# EAGLE board SNCHN_II-01 (EAGLE 5.11), part 1 of 3
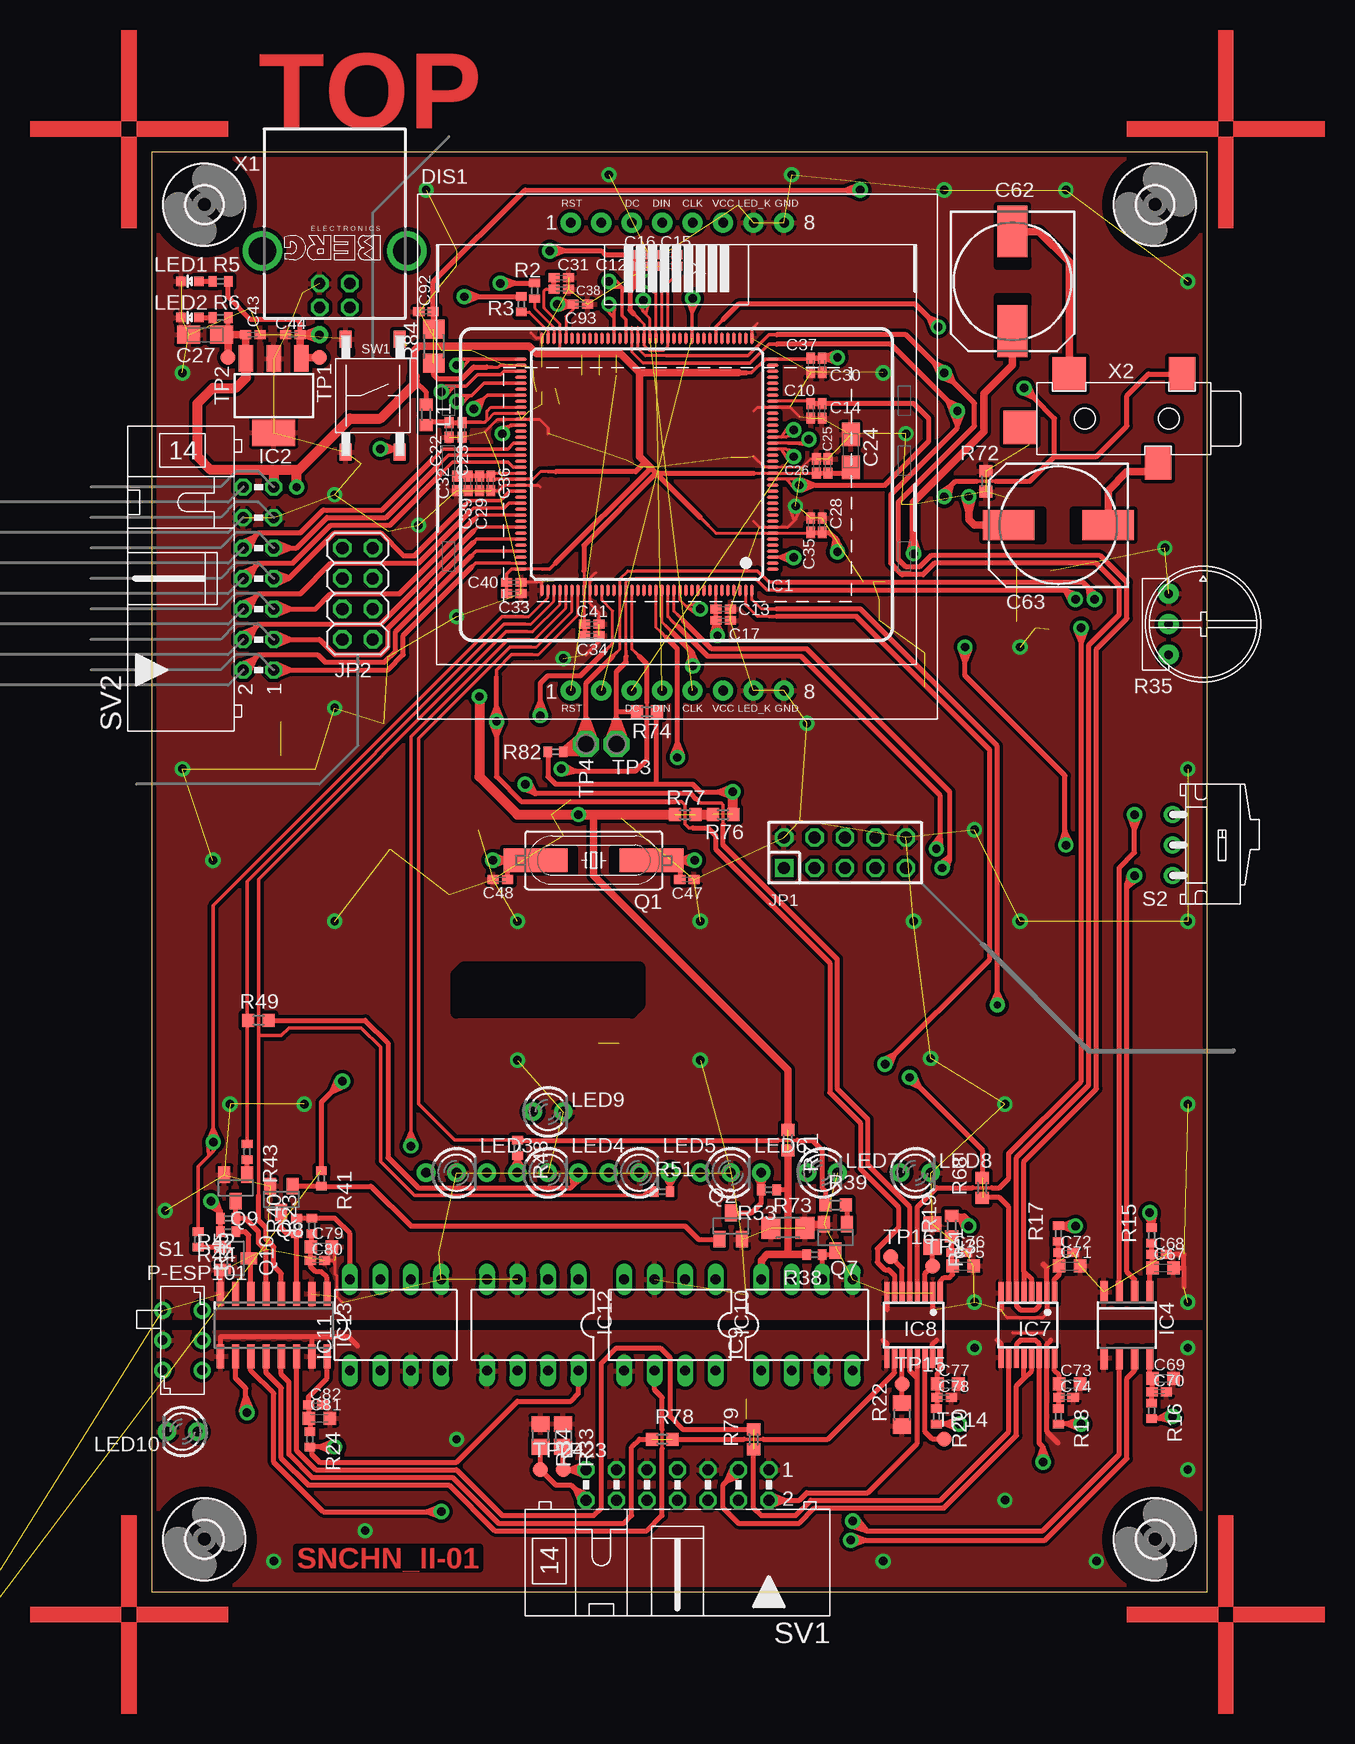
[diagram p3: board, top side]
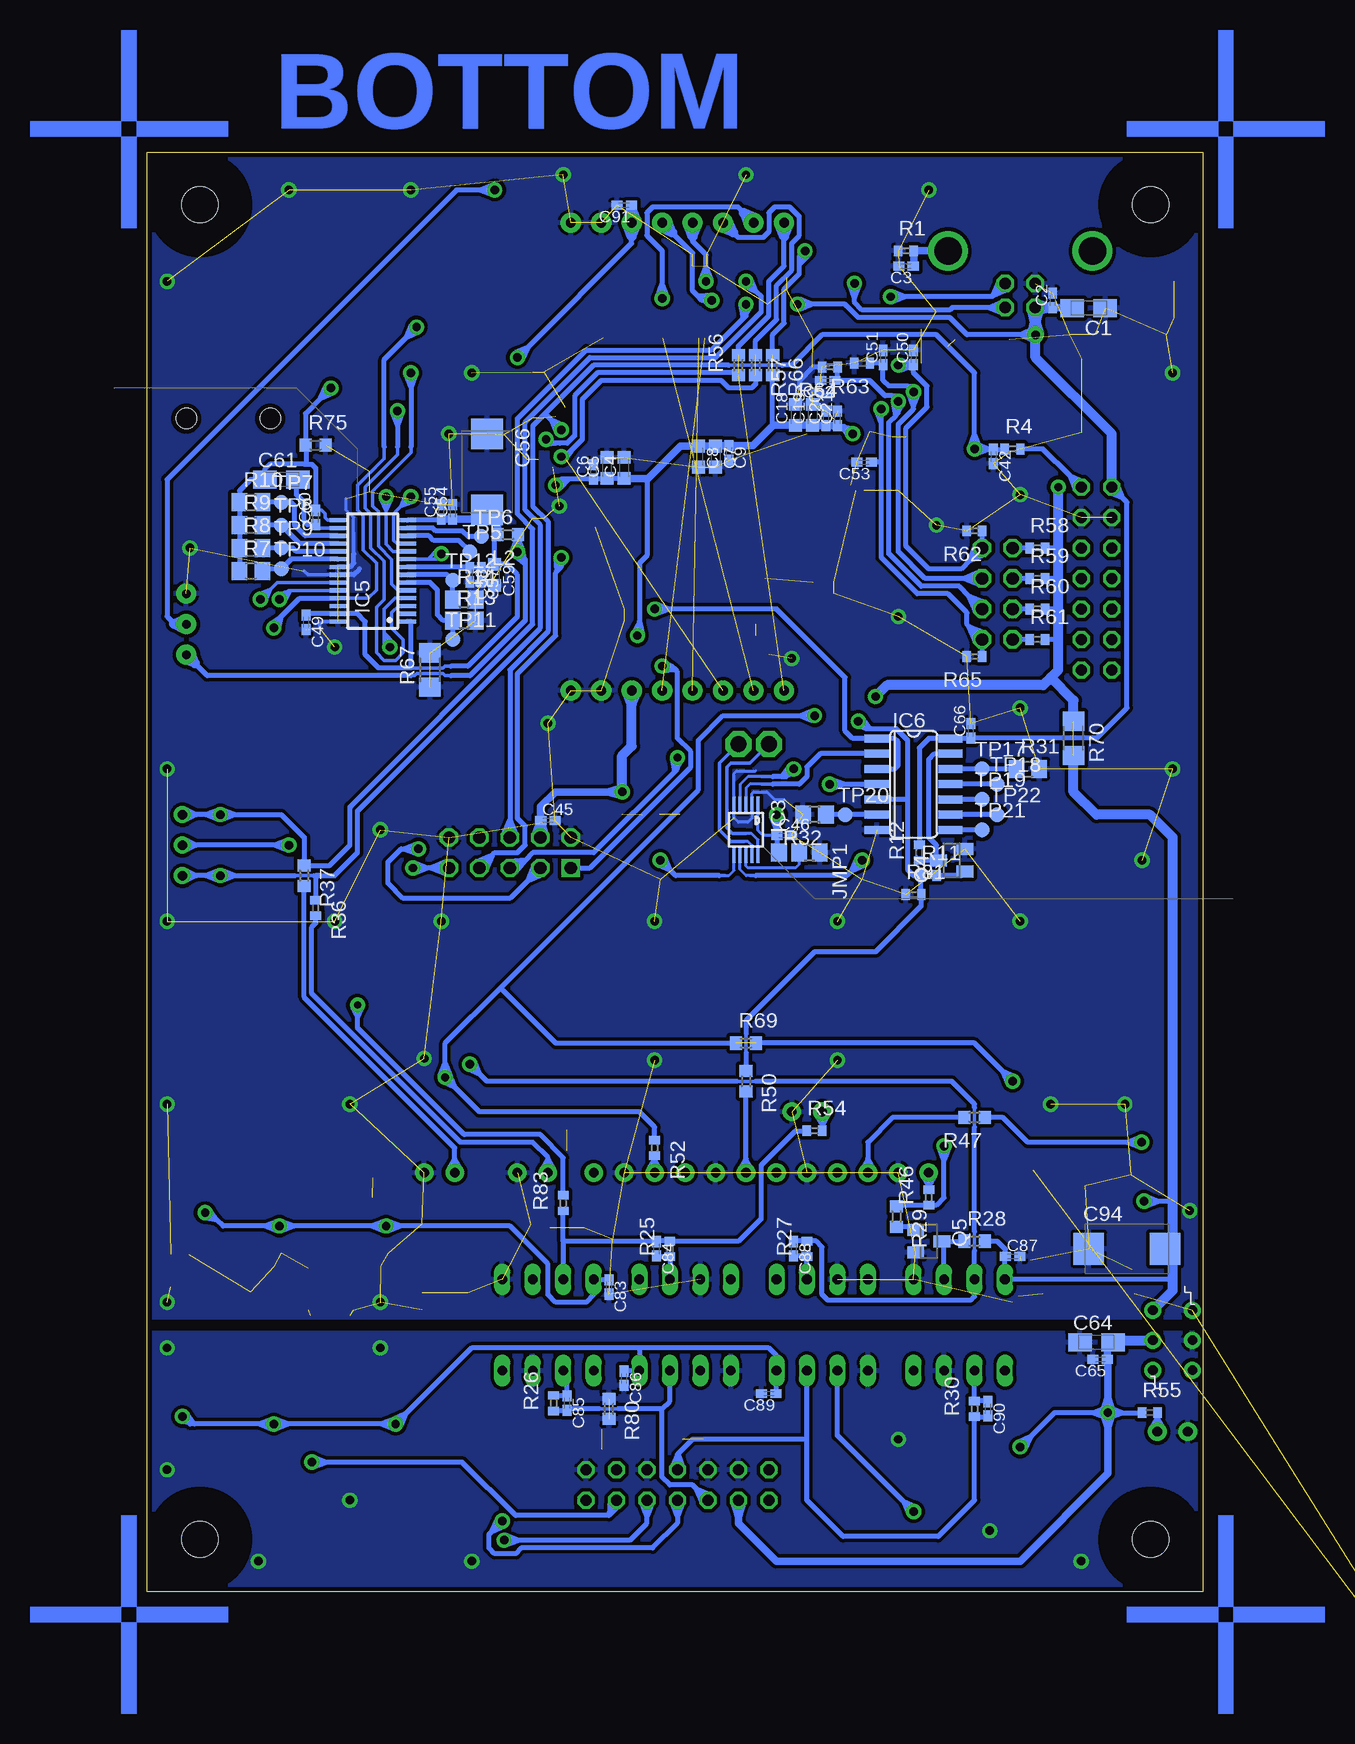
[diagram p4: board, bottom side, seen from below]

Size 88 x 120 mm. Coordinates in mm from the lower left corner, seen from the top.
Outline: 88,0 88,120 0,120 0,0 88,0
Copper layers (1*16): Top 0.035mm / dielectric 1.5mm / Bottom 0.035mm
Design rules "ALPS leptarna_clearance_0_2_mm_via_not_strict *": minimum track width 0.19mm, minimum drill 0.3mm, track to track 0.2mm, track to pad 0.2mm, pad to pad 0.2mm, via to via 0.2mm, smd to smd 0.2mm, copper to edge 0.4mm, drill to drill 0.5mm, minimum pad ring 10mil, minimum via ring 8mil, stop-mask expansion 3mil, vias tented up to drill 0mil, thermal gap 10mil
tRestrict: area 25.4,48.3 to 40.6,52.1; area 70.5,107.3 to 73,107.9; area 70.5,110.5 to 73,111.1; area 76.8,87.6 to 77.5,90.2; area 73.7,87.6 to 74.3,90.2; area 34.9,60 to 35.2,61.9; area 38.4,60 to 38.7,61.9; area 15.7,95.9 to 16.7,96.2; area 20.2,95.9 to 21.1,96.2; area 15.7,103.2 to 16.7,103.5; area 20.2,103.2 to 21.1,103.5

## Footprints (pad centres in the part's own frame; a part is rotated, then mirrored left to right if it is on the bottom)
A/3216-18R = smd 1.95 x 1.5: + 1.375,0; - -1.375,0
C0402K = smd 0.925 x 0.74: 1 -0.6,0; 2 0.6,0
C0603R = smd 1.05 x 1.08: 1 -0.875,0; 2 0.875,0
D/7343-31R = smd 2.55 x 2.7: + 3.175,0; - -3.175,0
140CLH-1010 = smd 4.3 x 2.5: + 4.15,0; - -4.15,0
LCD_NOKIA_5510_PLUS_EXT_BRD = drill 0.8 pad 1.676 round: 1 -8.89,19.5; 1@1 -8.89,-19.5; 2 -6.35,19.5; 2@1 -6.35,-19.5; 3 -3.81,19.5; 3@1 -3.81,-19.5; 4 -1.27,19.5; 4@1 -1.27,-19.5; 5 1.27,19.5; 5@1 1.27,-19.5; 6 3.81,19.5; 6@1 3.81,-19.5; 7 6.35,19.5; 7@1 6.35,-19.5; 8 8.89,19.5; 8@1 8.89,-19.5
LQFP144 = smd 0.25 x 1: 1 -8.75,-10.5; 2 -8.25,-10.5; 3 -7.75,-10.5; 4 -7.25,-10.5; 5 -6.75,-10.5; 6 -6.25,-10.5; 7 -5.75,-10.5; 8 -5.25,-10.5; 9 -4.75,-10.5; 10 -4.25,-10.5; 11 -3.75,-10.5; 12 -3.25,-10.5; 13 -2.75,-10.5; 14 -2.25,-10.5; 15 -1.75,-10.5; 16 -1.25,-10.5; 17 -0.75,-10.5; 18 -0.25,-10.5; 19 0.25,-10.5; 20 0.75,-10.5; 21 1.25,-10.5; 22 1.75,-10.5; 23 2.25,-10.5; 24 2.75,-10.5; 25 3.25,-10.5; 26 3.75,-10.5; 27 4.25,-10.5; 28 4.75,-10.5; 29 5.25,-10.5; 30 5.75,-10.5; 31 6.25,-10.5; 32 6.75,-10.5; 33 7.25,-10.5; 34 7.75,-10.5; 35 8.25,-10.5; 36 8.75,-10.5; 73 8.75,10.5; 74 8.25,10.5; 75 7.75,10.5; 76 7.25,10.5; 77 6.75,10.5; 78 6.25,10.5; 79 5.75,10.5; 80 5.25,10.5; 81 4.75,10.5; 82 4.25,10.5; 83 3.75,10.5; 84 3.25,10.5; 85 2.75,10.5; 86 2.25,10.5; 87 1.75,10.5; 88 1.25,10.5; 89 0.75,10.5; 90 0.25,10.5; 91 -0.25,10.5; 92 -0.75,10.5; 93 -1.25,10.5; 94 -1.75,10.5; 95 -2.25,10.5; 96 -2.75,10.5; 97 -3.25,10.5; 98 -3.75,10.5; 99 -4.25,10.5; 100 -4.75,10.5; 101 -5.25,10.5; 102 -5.75,10.5; 103 -6.25,10.5; 104 -6.75,10.5; 105 -7.25,10.5; 106 -7.75,10.5; 107 -8.25,10.5; 108 -8.75,10.5 | smd 1 x 0.25: 37 10.5,-8.75; 38 10.5,-8.25; 39 10.5,-7.75; 40 10.5,-7.25; 41 10.5,-6.75; 42 10.5,-6.25; 43 10.5,-5.75; 44 10.5,-5.25; 45 10.5,-4.75; 46 10.5,-4.25; 47 10.5,-3.75; 48 10.5,-3.25; 49 10.5,-2.75; 50 10.5,-2.25; 51 10.5,-1.75; 52 10.5,-1.25; 53 10.5,-0.75; 54 10.5,-0.25; 55 10.5,0.25; 56 10.5,0.75; 57 10.5,1.25; 58 10.5,1.75; 59 10.5,2.25; 60 10.5,2.75; 61 10.5,3.25; 62 10.5,3.75; 63 10.5,4.25; 64 10.5,4.75; 65 10.5,5.25; 66 10.5,5.75; 67 10.5,6.25; 68 10.5,6.75; 69 10.5,7.25; 70 10.5,7.75; 71 10.5,8.25; 72 10.5,8.75; 109 -10.5,8.75; 110 -10.5,8.25; 111 -10.5,7.75; 112 -10.5,7.25; 113 -10.5,6.75; 114 -10.5,6.25; 115 -10.5,5.75; 116 -10.5,5.25; 117 -10.5,4.75; 118 -10.5,4.25; 119 -10.5,3.75; 120 -10.5,3.25; 121 -10.5,2.75; 122 -10.5,2.25; 123 -10.5,1.75; 124 -10.5,1.25; 125 -10.5,0.75; 126 -10.5,0.25; 127 -10.5,-0.25; 128 -10.5,-0.75; 129 -10.5,-1.25; 130 -10.5,-1.75; 131 -10.5,-2.25; 132 -10.5,-2.75; 133 -10.5,-3.25; 134 -10.5,-3.75; 135 -10.5,-4.25; 136 -10.5,-4.75; 137 -10.5,-5.25; 138 -10.5,-5.75; 139 -10.5,-6.25; 140 -10.5,-6.75; 141 -10.5,-7.25; 142 -10.5,-7.75; 143 -10.5,-8.25; 144 -10.5,-8.75
SOT223(S) = smd 1.219 x 2.235: 1 -2.311,-3.099; 2 0,-3.099; 3 2.311,-3.099 | smd 3.6 x 2.2: 4 0,3.099
MSOP10 = smd 0.25 x 1.3: 1 -1,-2.113; 2 -0.5,-2.113; 3 0,-2.113; 4 0.5,-2.113; 5 1,-2.113; 6 1,2.113; 7 0.5,2.113; 8 0,2.113; 9 -0.5,2.113; 10 -1,2.113
SOIC8 = smd 0.6 x 1.9: 1 -1.905,-2.75; 2 -0.635,-2.75; 3 0.635,-2.75; 4 1.905,-2.75; 5 1.905,2.75; 6 0.635,2.75; 7 -0.635,2.75; 8 -1.905,2.75
TSSOP28 = smd 0.35 x 1.4: 1 -4.225,-2.9; 2 -3.575,-2.9; 3 -2.925,-2.9; 4 -2.275,-2.9; 5 -1.625,-2.9; 6 -0.975,-2.9; 7 -0.325,-2.9; 8 0.325,-2.9; 9 0.975,-2.9; 10 1.625,-2.9; 11 2.275,-2.9; 12 2.925,-2.9; 13 3.575,-2.9; 14 4.225,-2.9; 15 4.225,2.9; 16 3.575,2.9; 17 2.925,2.9; 18 2.275,2.9; 19 1.625,2.9; 20 0.975,2.9; 21 0.325,2.9; 22 -0.325,2.9; 23 -0.975,2.9; 24 -1.625,2.9; 25 -2.275,2.9; 26 -2.925,2.9; 27 -3.575,2.9; 28 -4.225,2.9
SO14 = smd 0.66 x 2.032: 1 -3.81,-3.073; 2 -2.54,-3.073; 3 -1.27,-3.073; 4 0,-3.073; 5 1.27,-3.073; 6 2.54,-3.073; 7 3.81,-3.073; 8 3.81,3.073; 9 2.54,3.073; 10 1.27,3.073; 11 0,3.073; 12 -1.27,3.073; 13 -2.54,3.073; 14 -3.81,3.073
QSOP16 = smd 0.45 x 1.8: 1 -2.223,-2.69; 2 -1.587,-2.69; 3 -0.953,-2.69; 4 -0.318,-2.69; 5 0.318,-2.69; 6 0.953,-2.69; 7 1.587,-2.69; 8 2.223,-2.69; 9 2.223,2.69; 10 1.587,2.69; 11 0.953,2.69; 12 0.318,2.69; 13 -0.318,2.69; 14 -0.953,2.69; 15 -1.587,2.69; 16 -2.223,2.69
DIL08 = drill 0.813 long: 1 -3.81,-3.81; 2 -1.27,-3.81; 3 1.27,-3.81; 4 3.81,-3.81; 5 3.81,3.81; 6 1.27,3.81; 7 -1.27,3.81; 8 -3.81,3.81
SOIC16N = smd 0.6 x 2: 1 -4.445,-2.6; 2 -3.175,-2.6; 3 -1.905,-2.6; 4 -0.635,-2.6; 5 0.635,-2.6; 6 1.905,-2.6; 7 3.175,-2.6; 8 4.445,-2.6; 9 4.445,2.6; 10 3.175,2.6; 11 1.905,2.6; 12 0.635,2.6; 13 -0.635,2.6; 14 -1.905,2.6; 15 -3.175,2.6; 16 -4.445,2.6
A0R-JMP = smd 1.5 x 1.3: 1 0,1.7; 2 0,0; 3 0,-1.7
AVR-JTAG-10 = drill 1.016 square: 1 -5.08,-1.27 | drill 1.016 octagon: 2 -5.08,1.27; 3 -2.54,-1.27; 4 -2.54,1.27; 5 0,-1.27; 6 0,1.27; 7 2.54,-1.27; 8 2.54,1.27; 9 5.08,-1.27; 10 5.08,1.27
2X04 = drill 1.016 octagon: 1 -3.81,-1.27; 2 -3.81,1.27; 3 -1.27,-1.27; 4 -1.27,1.27; 5 1.27,-1.27; 6 1.27,1.27; 7 3.81,-1.27; 8 3.81,1.27
L0603 = smd 1 x 1.1: 1 -0.85,0; 2 0.85,0
LED-0603 = smd 0.8 x 0.8: A 0,-0.75; C 0,0.75
DUOLED-C-3MM = drill 0.8 pad 1.55 round: AR 2.54,0; AX -2.54,0; C 0,0
LED3MM = drill 0.8 pad 1.55 round: A -1.27,0; K 1.27,0
HC49UP = smd 5.334 x 1.93: 1 -4.826,0; 2 4.826,0
SOT23 = smd 1 x 1.4: 1 -0.95,-1.1; 2 0.95,-1.1; 3 0,1.1
R0402 = smd 0.7 x 0.9: 1 -0.65,0; 2 0.65,0
R0805 = smd 1.3 x 1.5: 1 -0.95,0; 2 0.95,0
R0603 = smd 1 x 1.1: 1 -0.85,0; 2 0.85,0
TRIM_3352T = drill 0.7 pad 1.676 round: 1 -2.54,2.21; 2 0,2.21; 3 2.54,2.21
R1206 = smd 1.6 x 1.803: 1 -1.422,0; 2 1.422,0
JS202011AQN = drill 0.8 pad 1.422 round: 1 -2.5,1.65; 2 0,1.65; 3 2.5,1.65; 4 -2.5,-1.65; 5 0,-1.65; 6 2.5,-1.65
P-ESP201X = drill 0.8 pad 1.422 round: O -2.54,-3.175; P 0,-3.175; S 2.54,-3.175
ML14L = drill 0.914 octagon: 1 -7.62,-1.27; 2 -7.62,1.27; 3 -5.08,-1.27; 4 -5.08,1.27; 5 -2.54,-1.27; 6 -2.54,1.27; 7 0,-1.27; 8 0,1.27; 9 2.54,-1.27; 10 2.54,1.27; 11 5.08,-1.27; 12 5.08,1.27; 13 7.62,-1.27; 14 7.62,1.27
B1720/SMD = smd 1.4 x 1: P$1 4.7,-2.25; P$2 -4.7,-2.25; P$3 4.7,2.25; P$4 -4.7,2.25
B1,27 = smd 1.27 x 1.27: PP 0,0
P1-13 = drill 1.321 pad 2.159 octagon: 1 0,0
3,0 = hole 3: 0,0
PN61729-S = drill 0.95 octagon: 1 1.25,4.71; 2 -1.25,4.71; 3 -1.25,2.71; 4 1.25,2.71 | drill 2.3 pad 2.9 round: S1 -6.02,0; S2 6.02,0
STEREO_JACK_3.5MM_SMD_SJ-352X-SMT = smd 2.8 x 2.2: P$1 -3.7,-2.4; P$3 3.7,-4.4 | smd 2.8 x 2.8: P$2 -3.7,-11.8; P$10 0.75,-15.9 | hole 1.7: 0,-3.5; 0,-10.5

## Placement (x,y rotation side)
C1  4.7uF  [A/3216-18R]  9.53,107 180 bottom
C2  100n  [C0402K]  12.54,107.63 90 bottom
C3  10n  [C0402K]  24.77,110.49 180 bottom
C4  1uF  [C0603R]  48.26,93.66 90 bottom
C5  1uF  [C0603R]  49.69,93.66 90 bottom
C6  470p  [C0402K]  50.8,93.34 90 bottom
C7  1uF  [C0603R]  40.64,94.61 270 bottom
C8  1uF  [C0603R]  42.07,94.61 270 bottom
C9  100n  [C0402K]  39.53,94.93 270 bottom
C10  2.7n  [C0402K]  54.93,98.42 270 top
C11  2.7n  [C0402K]  43.18,110.49 180 top
C12  2.7n  [C0402K]  40.8,110.49 0 top
C13  2.7n  [C0402K]  47.62,81.92 0 top
C14  33n  [C0402K]  55.88,98.42 270 top
C15  33n  [C0402K]  43.18,111.44 180 top
C16  33n  [C0402K]  40.8,111.44 0 top
C17  33n  [C0402K]  47.62,80.96 0 top
C18  1uF  [C0603R]  33.97,98.11 90 bottom
C19  1uF  [C0603R]  32.54,98.11 90 bottom
C20  33n  [C0402K]  31.43,97.79 90 bottom
C21  2.7n  [C0402K]  30.48,97.79 90 bottom
C22  100n  [C0402K]  24.77,96.84 270 top
C23  33n  [C0402K]  25.88,96.84 270 top
C24  4.7uF  [A/3216-18R]  58.26,95.09 270 top
C25  100n  [C0402K]  56.36,93.82 90 top
C26  33n  [C0402K]  55.4,93.82 90 top
C27  4.7uF  [A/3216-18R]  4.45,104.78 0 top
C28  100n  [C0402K]  55.88,88.9 90 top
C29  100n  [C0402K]  27.3,92.39 270 top
C30  100n  [C0402K]  55.88,102.23 270 top
C31  100n  [C0402K]  34.13,109.54 0 top
C32  100n  [C0402K]  25.4,92.39 270 top
C33  100n  [C0402K]  30.16,83.19 0 top
C34  100n  [C0402K]  36.67,79.69 0 top
C35  33n  [C0402K]  54.93,88.9 90 top
C36  33n  [C0402K]  28.26,92.39 270 top
C37  33n  [C0402K]  54.93,102.23 270 top
C38  33n  [C0402K]  34.13,108.58 0 top
C39  33n  [C0402K]  26.35,92.39 270 top
C40  33n  [C0402K]  30.16,84.14 0 top
C41  33n  [C0402K]  36.67,80.64 0 top
C42  100n  [C0402K]  17.46,94.61 270 bottom
C43  100n  [C0402K]  8.41,104.78 0 top
C44  100n  [C0402K]  11.75,104.78 180 top
C45  100n  [C0402K]  54.61,64.29 0 bottom
C46  100n  [C0402K]  34.92,63.02 0 bottom
C47  18pF  [C0402K]  44.61,59.37 0 top
C48  18pF  [C0402K]  29.05,59.37 180 top
C49  100n  [C0402K]  74.77,80.8 270 bottom
C50  100n  [C0402K]  24.13,102.87 90 bottom
C51  100n  [C0402K]  26.67,102.87 90 bottom
C52  100n  [C0402K]  31.27,100.97 180 bottom
C53  100n  [C0402K]  28.26,94.14 180 bottom
C54  100n  [C0402K]  62.55,90.01 90 bottom
C55  100n  [C0402K]  63.5,90.01 90 bottom
C56  100uF  [D/7343-31R]  59.69,93.34 270 bottom
C57  100n  [C0402K]  60.17,84.77 270 bottom
C58  100n  [C0402K]  61.12,84.77 270 bottom
C59  1uF  [C0603R]  59.05,84.77 270 bottom
C60  100n  [C0402K]  73.98,89.53 90 bottom
C61  4.7uF/16V  [A/3216-18R]  76.83,92.71 0 bottom
C62  220uF/16V  [140CLH-1010]  71.75,109.22 270 top
C63  220uF/16V  [140CLH-1010]  75.56,88.9 180 top
C64  4.7uF  [A/3216-18R]  8.89,20.8 0 bottom
C65  100n  [C0402K]  8.57,19.37 180 bottom
C66  100n  [C0402K]  19.37,71.75 90 bottom
C67  1uF  [C0603R]  84.3,26.99 0 top
C68  100n  [C0402K]  83.98,28.1 0 top
C69  1uF  [C0603R]  84.3,17.78 0 top
C70  100n  [C0402K]  83.98,16.67 0 top
C71  1uF  [C0603R]  76.52,27.15 0 top
C72  100n  [C0402K]  76.2,28.26 0 top
C73  1uF  [C0603R]  76.52,17.3 0 top
C74  100n  [C0402K]  76.2,16.19 0 top
C75  1uF  [C0603R]  67.63,27.15 0 top
C76  100n  [C0402K]  67.31,28.26 0 top
C77  1uF  [C0603R]  66.36,17.3 0 top
C78  100n  [C0402K]  66.04,16.19 0 top
C79  1uF  [C0603R]  14.13,28.73 0 top
C80  100n  [C0402K]  13.81,27.62 0 top
C81  1uF  [C0603R]  13.97,14.45 0 top
C82  100n  [C0402K]  13.65,15.56 0 top
C83  100n  [C0402K]  49.53,25.4 270 bottom
C84  //33pF  [C0402K]  45.56,28.57 270 bottom
C85  33pF  [C0402K]  53.02,15.72 270 bottom
C86  100n  [C0402K]  48.26,17.78 270 bottom
C87  100n  [C0402K]  15.88,27.94 0 bottom
C88  //33pF  [C0402K]  34.13,28.57 270 bottom
C89  100n  [C0402K]  36.2,16.51 180 bottom
C90  33pF  [C0402K]  17.94,15.24 270 bottom
C91  100n  [C0402K]  48.26,115.57 180 bottom
C92  100n  [C0402K]  22.86,106.68 0 top
C93  100n  [C0402K]  35.72,107.31 180 top
C94  100uF  [D/7343-31R]  6.35,28.57 0 bottom
DIS1  LCD_NOKIA_5510  [LCD_NOKIA_5510_PLUS_EXT_BRD]  43.81,94.61 0 top
IC1  32UC3A0512  [LQFP144]  41.27,93.98 90 top
IC2  MIC39100  [SOT223(S)]  10.16,99.69 180 top
IC3  CS2200  [MSOP10]  38.1,63.5 180 bottom
IC4  SI8421  [SOIC8]  81.28,22.23 180 top
IC5  TLV320AIC23B  [TSSOP28]  69.22,85.09 90 bottom
IC6  4066D  [SO14]  24.13,67.31 270 bottom
IC7  SI8642  [QSOP16]  73.03,22.23 180 top
IC8  SI8642  [QSOP16]  63.5,22.23 180 top
IC9  TLP22OO  [DIL08]  54.61,22.23 0 top
IC10  TLP22OO  [DIL08]  43.18,22.23 180 top
IC11  TLP22OO  [DIL08]  20.32,22.23 0 top
IC12  TLP22OO  [DIL08]  31.75,22.23 180 top
IC13  SI8640  [SOIC16N]  10.16,22.23 180 top
JMP1  0R-JUMPA  [A0R-JMP]  33.66,61.59 270 bottom
JP1  AVR-JTAG-10  [AVR-JTAG-10]  57.78,61.59 0 top
JP2  GPBTN[3:0]  [2X04]  17.14,83.19 270 top
L1  1.5 kOhm@100MHz  [L0603]  22.86,98.11 270 top
L2  1.5 kOhm@100MHz  [L0603]  57.94,88.11 180 bottom
LED1  Green@3mA  [LED-0603]  3.17,109.22 90 top
LED2  //Green@3mA  [LED-0603]  3.18,106.2 90 top
LED3  Red/Green@3mA  [DUOLED-C-3MM]  25.4,34.92 0 top
LED4  Red/Green@3mA  [DUOLED-C-3MM]  33.02,34.92 0 top
LED5  Red/Green@3mA  [DUOLED-C-3MM]  40.64,34.92 0 top
LED6  Red/Green@3mA  [DUOLED-C-3MM]  48.26,34.92 0 top
LED7  Green@3mA  [LED3MM]  55.88,34.92 0 top
LED8  Green@3mA  [LED3MM]  63.66,34.92 0 top
LED9  Red@3mA  [LED3MM]  33.02,40.01 0 top
LED10  Green@3mA  [LED3MM]  2.54,13.34 180 top
Q1  12 MHz  [HC49UP]  36.83,60.96 180 top
Q2  BSS138  [SOT23]  48.26,30.48 0 top
Q4  BSS138  [SOT23]  20.95,60.96 90 bottom
Q5  BSS138  [SOT23]  22.86,29.21 270 bottom
Q7  BSS138  [SOT23]  56.99,29.53 180 top
Q8  BSS138  [SOT23]  10.79,32.7 180 top
Q9  BSS138  [SOT23]  6.99,33.66 180 top
Q10  BSS138  [SOT23]  6.99,27.78 270 top
R1  1M0  [R0402]  24.77,111.76 0 bottom
R2  39R  [R0402]  31.91,108.43 270 top
R3  39R  [R0402]  30.8,107.31 270 top
R4  10k  [R0402]  15.88,95.25 0 bottom
R5  470R  [R0402]  5.71,109.22 0 top
R6  //470R  [R0402]  5.71,106.2 0 top
R7  0R  [R0805]  79.38,85.09 0 bottom
R8  0R  [R0805]  79.38,87 0 bottom
R9  0R  [R0805]  79.38,88.9 0 bottom
R10  100k  [R0805]  79.38,90.81 0 bottom
R11  10k  [R0402]  22.86,59.69 0 bottom
R12  47k  [R0402]  23.65,61.6 90 bottom
R13  100k  [R0805]  61.59,80.96 0 bottom
R14  100k  [R0805]  61.59,82.71 0 bottom
R15  20R  [R0402]  83.34,29.69 90 top
R16  20R  [R0402]  83.34,15.08 270 top
R17  20R  [R0402]  75.56,29.84 90 top
R18  20R  [R0402]  75.56,14.61 270 top
R19  20R  [R0603]  66.67,30.48 90 top
R20  20R  [R0402]  65.41,14.61 270 top
R21  0R  [R0805]  65.09,29.69 270 top
R22  0R  [R0805]  62.55,14.76 90 top
R23  20R  [R0402]  13.34,30.48 90 top
R24  20R  [R0402]  13.18,12.7 270 top
R25  270R  [R0402]  44.45,28.57 90 bottom
R26  1k1  [R0402]  54.13,15.72 90 bottom
R27  1k1  [R0402]  33.02,28.57 90 bottom
R28  47k  [R0603]  19.05,29.21 0 bottom
R29  10k  [R0603]  25.56,31.27 270 bottom
R30  1k1  [R0402]  19.05,15.24 90 bottom
R31  0R  [R0805]  14.61,68.58 0 bottom
R32  0R  [R0805]  32.38,64.77 180 bottom
R33  0R  [R0805]  34.29,13.02 270 top
R34  0R  [R0805]  32.38,13.02 270 top
R35  Volume  [TRIM_3352T]  82.55,80.64 270 top
R36  510R  [R0402]  73.98,56.99 270 bottom
R37  510R  [R0603]  74.93,59.69 270 bottom
R38  47k  [R0402]  55.24,28.1 180 top
R39  10k  [R0603]  56.99,32.23 0 top
R40  47k  [R0402]  12.06,30.48 90 top
R41  10k  [R0402]  14.13,34.45 270 top
R42  47k  [R0402]  6.35,31.11 180 top
R43  10k  [R0402]  7.94,36.67 270 top
R44  47k  [R0402]  6.35,30 180 top
R45  10k  [R0402]  3.85,29.36 270 top
R46  510R  [R0402]  22.86,32.86 90 bottom
R47  510R  [R0603]  19.05,39.53 180 bottom
R48  510R  [R0402]  30.48,36.99 270 top
R49  510R  [R0603]  8.89,47.62 0 top
R50  510R  [R0603]  38.1,42.55 270 bottom
R51  510R  [R0402]  42.55,33.34 0 top
R52  510R  [R0402]  45.72,36.99 270 bottom
R53  510R  [R0402]  51.44,33.5 180 top
R54  30R  [R0402]  32.38,38.42 0 bottom
R55  510R  [R0402]  4.45,14.92 0 bottom
R56  0R  [R0603]  38.73,102.23 90 bottom
R57  0R  [R0603]  37.31,102.23 270 bottom
R58  1k  [R0402]  13.81,87 0 bottom
R59  1k  [R0402]  13.81,84.45 0 bottom
R60  1k  [R0402]  13.81,81.92 0 bottom
R61  1k  [R0402]  13.81,79.38 0 bottom
R62  22k  [R0402]  19.05,88.42 180 bottom
R63  22k  [R0402]  28.42,102.39 180 bottom
R64  22k  [R0402]  31.11,102.08 180 bottom
R65  22k  [R0402]  19.05,77.95 180 bottom
R66  0R  [R0603]  35.88,102.23 270 bottom
R67  0R  [R1206]  64.45,76.83 90 bottom
R68  0R  [R0603]  69.22,33.66 90 top
R69  0R  [R0603]  38.1,45.72 0 bottom
R70  0R  [R1206]  10.79,71.12 270 bottom
R71  0R  [R0603]  53.02,37.62 270 top
R72  0R  [R0603]  69.53,92.55 90 top
R73  0R  [R1206]  53.02,30.32 0 top
R74  10k  [R0603]  41.27,73.34 0 top
R75  0R  [R0603]  73.98,95.57 0 bottom
R76  0R  [R0603]  47.62,64.77 180 top
R77  0R  [R0603]  44.45,64.77 0 top
R78  0R  [R0603]  42.55,12.7 0 top
R79  0R  [R0603]  50.16,12.7 90 top
R80  0R  [R0603]  49.53,15.24 270 bottom
R81  10k  [R0402]  24.13,58.1 0 bottom
R82  10k  [R0402]  33.66,70.01 180 top
R83  330R  [R0402]  53.34,32.38 90 bottom
R84  0R  [R1206]  23.5,103.82 90 top
R85  47k  [R0402]  -27.94,-21.59 0 top  (outside the outline)
S1  P-ESP101  [JS202011AQN]  2.54,20.95 270 top
S2  I2S_SOURCE  [P-ESP201X]  88.27,62.23 270 top
SV1  I2S connector  [ML14L]  43.81,8.89 180 top
SV2  DEBUG_GPIO  [ML14L]  8.89,84.45 90 top
SW1  [B1720/SMD]  18.41,99.69 270 top
TP1  PTR1B1,27  [B1,27]  13.97,102.87 0 top
TP2  PTR1B1,27  [B1,27]  6.35,102.87 0 top
TP3  PTR1PAD1-13  [P1-13]  38.73,70.64 0 top
TP4  PTR1PAD1-13  [P1-13]  36.2,70.64 0 top
TP5  PTR1B1,27  [B1,27]  61.12,86.68 0 bottom
TP6  PTR1B1,27  [B1,27]  60.17,87.95 0 bottom
TP7  PTR1B1,27  [B1,27]  76.83,90.81 0 bottom
TP8  PTR1B1,27  [B1,27]  76.83,88.9 0 bottom
TP9  PTR1B1,27  [B1,27]  76.83,87 0 bottom
TP10  PTR1B1,27  [B1,27]  76.83,85.25 0 bottom
TP11  PTR1B1,27  [B1,27]  62.55,79.38 0 bottom
TP12  PTR1B1,27  [B1,27]  62.55,84.3 0 bottom
TP13  PTR1B1,27  [B1,27]  65.09,27.15 0 top
TP14  PTR1B1,27  [B1,27]  66.04,12.7 0 top
TP15  PTR1B1,27  [B1,27]  62.55,17.3 0 top
TP16  PTR1B1,27  [B1,27]  61.59,27.94 0 top
TP17  PTR1B1,27  [B1,27]  18.41,68.58 0 bottom
TP18  PTR1B1,27  [B1,27]  17.14,67.31 0 bottom
TP19  PTR1B1,27  [B1,27]  18.41,66.04 0 bottom
TP20  PTR1B1,27  [B1,27]  29.84,64.77 0 bottom
TP21  PTR1B1,27  [B1,27]  18.41,63.5 0 bottom
TP22  PTR1B1,27  [B1,27]  17.14,64.77 0 bottom
TP23  PTR1B1,27  [B1,27]  34.29,10.16 0 top
TP24  PTR1B1,27  [B1,27]  32.38,10.16 0 top
U$1  [3,0]  4.38,115.62 0 top
U$2  [3,0]  83.62,115.62 0 top
U$3  [3,0]  83.62,4.38 0 top
U$4  [3,0]  4.38,4.38 0 top
U$5  [ANGLE-ARROW-NW1-16]  -1.27,121.28 0 top
U$6  [ANGLE-ARROW-NW1-16]  -2.54,122.56 180 top
U$7  [ANGLE-ARROW-NW1-16]  -1.27,-1.27 90 top
U$8  [ANGLE-ARROW-NW1-16]  -2.54,-2.54 270 top
U$9  [ANGLE-ARROW-NW1-16]  88.9,-1.27 180 top
U$10  [ANGLE-ARROW-NW1-16]  90.17,-2.54 0 top
U$11  [ANGLE-ARROW-NW1-16]  88.9,121.28 270 top
U$12  [ANGLE-ARROW-NW1-16]  90.17,122.56 90 top
X1  PN61729-S  [PN61729-S]  15.24,111.76 180 top
X2  [STEREO_JACK_3.5MM_SMD_SJ-352X-SMT]  88.27,97.79 270 top

## Tracks (layer width: path | path; a pad name or v marks a point on that pad's centre or on a via)
+1V8  (via drill 0.7 pad 1.27)  (1 unrouted)
  Top 0.254: C11.1 43.78,109.82 43.02,109.06 IC1.51 43.02,103.83 42.7,103.5 41.43,103.5 41.02,103.91 IC1.55 41.02,105.66 40.64,106.05 | C10.1 54.93,99.23 IC1.29 | C13.1 IC1.138 | 52.89,92.73 53.48,92.73 v53.98,92.23 | 52.89,92.73 IC1.16 | 52.89,92.73 53.59,91.91 v53.98,92.23 | 52.89,92.73 53.97,92.74 v53.98,92.23
  Top 0.305: 40.16,106.52 40.64,106.05 | 30.16,97.23 29.92,97.23 v29.21,96.52 | 30.16,97.23 IC1.84 | 30.16,97.23 29.1,96.99 v29.21,96.52 | v29.21,96.52 29.63,96.28
  Top 0.406: 40.16,106.52 39.85,106.84 39.85,108.43 40.2,108.78 C12.1 | C11.1 | C11.1 C15.1 | C12.1 | C12.1 C16.1 37.78,111.44 37.47,111.76 34.37,111.76 | C14.1 | C14.1 C10.1 63.53,99.03 64.77,97.79 64.77,95.89 61.12,92.23 55.16,92.23 | C13.1 C17.1 47.02,80.88 | v53.98,92.23 55.16,92.23 | v47.15,79.69 47.02,79.82 47.02,80.88 | v33.18,111.76 34.37,111.76 | 55.16,92.23 | 55.16,92.23 54.13,92.64 | 55.16,92.23 54.13,91.83 | 54.13,92.64 | v53.98,92.23 54.13,92.64 | 54.13,91.83 | 34.37,111.76 | 34.37,111.76 33.34,112.16 | 34.37,111.76 33.34,111.36 | 33.34,112.16 | v33.18,111.76 33.34,112.16 | 33.34,111.36 | 55.16,92.23 | 54.13,91.83 55.16,92.23 | 54.13,92.64 55.16,92.23 | 54.13,91.83 55.16,92.23 | v53.98,92.23 54.13,91.83 | 54.13,92.64 55.16,92.23 | v53.98,92.23 54.13,92.64 | 54.13,91.83 55.16,92.23 | v53.98,92.23 54.13,91.83 | 47.02,80.88 46.73,79.81 v47.15,79.69 | 47.02,80.88 47.53,79.89 v47.15,79.69 | 34.37,111.76 | 33.34,111.36 34.37,111.76 | 33.34,112.16 34.37,111.76 | 33.34,111.36 34.37,111.76 | v33.18,111.76 33.34,111.36 | 33.34,112.16 34.37,111.76 | v33.18,111.76 33.34,112.16 | 33.34,111.36 34.37,111.76 | v33.18,111.76 33.34,111.36
  Bottom 0.305: v29.21,96.52 29.88,97.19 30.19,97.19 | 30.19,97.19 C21.1 | 30.19,97.19 29.12,97 v29.21,96.52 | 30.19,97.19 29.62,96.27 v29.21,96.52
  Bottom 0.406: v53.98,92.23 53.46,92.75 52.9,92.75 | 52.9,92.75 C6.1 49.73,92.75 C5.1 C4.1 | 46.28,92.79 46.35,92.71 46.35,86.36 46.99,85.72 46.99,80.87 | 46.99,80.87 46.99,79.85 v47.15,79.69 | R66.1 35.88,104.78 34.92,105.73 34.92,108.58 33.66,109.86 33.66,110.67 | 33.66,110.67 33.66,111.28 v33.18,111.76 | R66.2 35.88,97.31 35.8,97.23 | 52.9,92.75 53.66,91.94 v53.98,92.23 | 52.9,92.75 54.01,92.66 v53.98,92.23 | 46.99,80.87 46.73,79.79 v47.15,79.69 | 46.99,80.87 47.53,79.9 v47.15,79.69 | 33.66,110.67 33.61,111.78 v33.18,111.76 | 33.66,110.67 32.87,111.45 v33.18,111.76
  Bottom 0.61: C4.1 46.28,92.79 43.58,95.49 C8.1 C7.1 40.6,95.53 C9.1 37.5,95.53 35.8,97.23 C18.1 C19.1 32.5,97.19 C20.1 C21.1
+3V3  (via drill 0.7 pad 1.27)  (4 unrouted)
  Top 0.254: C35.1 54.93,88.23 IC1.7 47.02,88.23 46.35,88.9 | C41.1 36.02,80.64 IC1.116 36.02,85.09 | 32.52,85.23 IC1.108 | 50.16,93.22 IC1.17 55.09,93.23 | IC1.93 31.77,92.73 32.38,93.34 33.02,93.34 | 28.26,93.23 IC1.92 | 34.02,103.19 IC1.69 34.02,105.67 32.7,107 32.7,108.43 32.86,108.58 C38.1
  Top 0.305: IC1.108 29.98,85.23 29.56,84.81 C40.1 C33.1 | C37.1 54.93,102.73 IC1.36 51.14,102.73 50.01,101.6 49.53,101.6 | 45.72,89.53 46.35,88.9 | 33.66,93.34 33.02,93.34 | IC1.93 28.52,92.73 C36.1 28.26,93.23 | 33.66,85.72 | 33.66,85.72 33.16,85.23 32.52,85.23 | 55.09,93.23 C26.1
  Top 0.406: R6.2 6.35,106.2 6.35,104.78 | C38.1 C31.1 | C30.1 C37.1 54.96,102.87 55.96,102.87 | C26.1 C25.1 57.77,93.22 C24.+ | C35.1 C28.1 56.48,88.3 56.93,87.85 | 42.03,93.22 50.16,93.22 | 42.03,93.22 41.59,93.66 33.66,85.72 33.64,85.71 | 42.03,93.22 45.72,89.53 | 36.02,85.09 36.02,87.21 42.03,93.22 | 33.66,93.34 40.32,93.34 41.12,94.14 | R40.2 R23.2 13.35,31.11 15.24,31.11 16.51,29.84 IC11.8 | C36.1 C29.1 | C29.1 | C29.1 C39.1 C32.1 | 55.96,102.87 v57.15,102.87 | 56.93,87.85 57.15,87.63 v57.15,86.68 | R44.2 R42.2 5.7,31.64 | v76.99,30.48 75.8,30.48 | R17.2 75.58,30.48 75.8,30.48 | 83.34,30.41 83.34,31.43 v83.19,31.59 | 83.34,30.41 R15.2 | 67.27,31.33 67.73,31.33 68.1,30.96 v68.1,30.48 | 67.27,31.33 R19.2 | C41.1 C34.1 | 48.42,64.83 R76.1 | 48.9,101.6 49.53,101.6 | 41.91,67.31 33.66,67.31 33.02,67.94 33.02,69.99 R82.2 | 41.91,67.31 45.09,67.31 45.72,66.67 47.23,66.67 | 47.23,66.67 v48.42,66.67 | 41.91,67.31 42.12,67.31 | 41.91,67.31 42.07,67.31 42.07,73.13 arc-90 R74.2 | v4.92,32.54 5.7,31.77 5.7,31.64 | R53.1 53.02,33.5 53.02,33.66 | 55.96,102.87 | 55.96,102.87 56.99,102.47 | 55.96,102.87 56.99,103.27 | 56.99,103.27 | 56.99,103.27 v57.15,102.87 | 75.8,30.48 | 75.8,30.48 76.84,30.08 | 75.8,30.48 76.84,30.88 | 76.84,30.88 | v76.99,30.48 76.84,30.88 | L1.1 22.86,100.01 21.91,100.97 | 56.93,87.85 56.73,86.76 v57.15,86.68 | 56.93,87.85 57.52,86.91 v57.15,86.68 | 55.96,102.87 | 56.99,102.47 55.96,102.87 | 56.99,102.47 | v57.15,102.87 56.99,102.47 | 56.99,103.27 55.96,102.87 | 55.96,102.87 56.99,102.47 | 55.96,102.87 56.99,103.27 | 56.99,102.47 55.96,102.87 | 56.99,102.47 v57.15,102.87 | 56.99,103.27 55.96,102.87 | 56.99,103.27 v57.15,102.87 | 5.7,31.64 5.33,32.69 v4.92,32.54
  Top 0.406: 5.7,31.64 4.72,32.16 v4.92,32.54 | 67.27,31.33 67.71,30.31 v68.1,30.48 | 67.27,31.33 68.28,30.87 v68.1,30.48 | 75.8,30.48 | 76.84,30.08 75.8,30.48 | 76.84,30.08 | v76.99,30.48 76.84,30.08 | 76.84,30.88 75.8,30.48 | 76.84,30.08 75.8,30.48 | 76.84,30.88 75.8,30.48 | 76.84,30.08 75.8,30.48 | v76.99,30.48 76.84,30.08 | 76.84,30.88 75.8,30.48 | v76.99,30.48 76.84,30.88 | 83.34,30.41 83.61,31.49 v83.19,31.59 | 83.34,30.41 82.81,31.38 v83.19,31.59 | 47.23,66.67 48.26,66.27 | v48.42,66.67 48.26,66.27 | 47.23,66.67 48.26,67.08 | v48.42,66.67 48.26,67.08 | 48.26,66.27 47.23,66.67 | 48.26,67.08 47.23,66.67 | 47.23,66.67 48.26,66.27 | v48.42,66.67 48.26,66.27 | 47.23,66.67 48.26,67.08 | v48.42,66.67 48.26,67.08
  Top 0.61: IC2.3 7.81,102.83 C43.1 6.35,104.78 C27.+ 6.35,104.25 TP2.PP | 41.59,93.66 41.12,94.14 40.64,94.61 40.64,101.6 | 53.02,28.1 51.28,28.1 50.8,27.62 IC9.8 | 53.02,28.1 R38.2 | 53.02,28.1 53.02,33.66 R71.2 | 36.83,64.77 36.83,59.69 53.02,43.5 R71.1 | 40.64,101.6 39.05,103.19 34.02,103.19 32.07,103.19 31.43,103.82 22.23,103.82 21.91,103.5 21.91,101.28 | 40.64,101.6 48.9,101.6
  Top 0.813: 10.16,93.5 SV2.13 | v27.3,74.61 27.3,67.94 30.48,64.77 v35.56,64.77 36.83,64.77 R77.1 | 12.22,93.5 16.51,97.79 19.05,97.79 21.91,100.65 21.91,100.97 21.91,101.28 | 12.22,93.5 10.16,93.5 | IC2.3 7.85,101.19 6.99,100.33 5.08,100.33 3.81,99.06 3.81,94.61 4.92,93.5 10.16,93.5 | v48.42,66.67 48.42,64.83 | R77.2 R76.2 | v12.06,92.08 12.06,93.5 12.22,93.5
  Bottom 0.254: 37.1,64.77 37.1,63.45 36.67,63.02 C46.1 | 37.1,64.77 IC3.1 | 37.1,64.77 37.1,64.93
  Bottom 0.305: 66.04,76.36 65.72,76.36 65.56,76.52 63.34,76.52 63.18,76.36 62.71,76.36
  Bottom 0.406: C91.1 47.62,115.53 47.62,115.28 DIS1.6 47.62,112.95 47.62,112.39 56.31,103.71 | SV2.13 11.1,93.01 | 11.1,93.01 13.34,95.25 R4.2 | R28.2 17.14,29.21 16.48,28.54 C87.1 16.51,27.91 IC11.8 2.54,26.04 | C83.1 50.8,26 IC9.8 50.8,24.77 51.44,24.13 53.98,24.13 54.61,24.77 54.61,27.3 57.78,30.48 66.91,30.48 | v35.56,64.77 35.56,63.58 | v57.15,86.68 57.15,87.87 | L2.1 57.15,88.11 57.15,87.87 | 12.06,87 R58.2 | 12.06,84.45 R59.2 | 12.06,81.92 R60.2 | 12.06,79.38 R61.2 | 3.73,32.54 v4.92,32.54 | 2.54,31.75 2.7,31.59 | v68.1,30.48 69.29,30.48 | 75.8,30.48 v76.99,30.48 | 47.62,73.95 DIS1.6@1 | 66.91,30.48 v68.1,30.48 | v57.15,102.87 56.31,103.71 | v57.15,86.68 56.52,86.04 56.52,85.67 | 56.52,85.67 56.52,80.96 61.12,76.36 62.71,76.36 | R35.3 84.04,77.39 83.01,76.36 66.04,76.36 | v76.99,30.48 78.18,30.48 | 82.18,30.96 v83.19,31.59 | 55.24,64.29 C45.1 55.24,64.26 | JMP1.3 35.52,61.77 C46.1 35.56,63.06 35.56,63.58 | 82.18,30.96 81.7,30.48 78.18,30.48 | 2.54,32.38 arc-90 2.7,32.54 3.73,32.54 | 2.54,28.57 C94.+ | 57.15,87.87 | 57.15,87.87 56.75,86.83 | 57.15,87.87 57.55,86.83 | 57.55,86.83 | v57.15,86.68 57.55,86.83 | 35.56,63.58 | 35.56,63.58 35.96,64.61 | 35.56,63.58 35.16,64.61 | 35.96,64.61 | v35.56,64.77 35.96,64.61 | 35.16,64.61 | 3.73,32.54 | 3.73,32.54 4.76,32.14 | 3.73,32.54 4.76,32.95 | 4.76,32.95 v4.92,32.54 | 66.91,30.48 | 69.29,30.48 68.26,30.88 | 69.29,30.48 68.26,30.08 | 68.26,30.88 | v68.1,30.48 68.26,30.88 | 68.26,30.08 | 66.91,30.48 67.95,30.08 | 66.91,30.48 67.95,30.88 | 67.95,30.88 | 67.95,30.88 v68.1,30.48 | 69.29,30.48 | 69.29,30.48 75.8,30.48 | 75.8,30.48 | 78.18,30.48 | 75.8,30.48 76.84,30.08 | 75.8,30.48 76.84,30.88 | 76.84,30.88 | 76.84,30.88 v76.99,30.48
  Bottom 0.406: 78.18,30.48 77.15,30.88 | 78.18,30.48 77.15,30.08 | 77.15,30.88 | v76.99,30.48 77.15,30.88 | 77.15,30.08 | 57.15,87.87 | 56.75,86.83 57.15,87.87 | 56.75,86.83 | v57.15,86.68 56.75,86.83 | 57.55,86.83 57.15,87.87 | 56.75,86.83 57.15,87.87 | 57.55,86.83 57.15,87.87 | 56.75,86.83 57.15,87.87 | v57.15,86.68 56.75,86.83 | 57.55,86.83 57.15,87.87 | v57.15,86.68 57.55,86.83 | 56.52,85.67 57.41,86.33 v57.15,86.68 | 56.52,85.67 56.73,86.76 v57.15,86.68 | 56.31,103.71 56.76,102.7 v57.15,102.87 | 56.31,103.71 57.32,103.27 v57.15,102.87 | 35.56,63.58 | 35.16,64.61 35.56,63.58 | 35.96,64.61 35.56,63.58 | 35.16,64.61 35.56,63.58 | v35.56,64.77 35.16,64.61 | 35.96,64.61 35.56,63.58 | v35.56,64.77 35.96,64.61 | 35.16,64.61 35.56,63.58 | v35.56,64.77 35.16,64.61 | 3.73,32.54 | 4.76,32.14 3.73,32.54 | 4.76,32.14 v4.92,32.54 | 4.76,32.95 3.73,32.54 | 3.73,32.54 4.76,32.14 | 3.73,32.54 4.76,32.95 | 4.76,32.14 3.73,32.54 | 4.76,32.14 v4.92,32.54 | 4.76,32.95 3.73,32.54 | 4.76,32.95 v4.92,32.54 | 66.91,30.48 | 69.29,30.48 | 68.26,30.08 69.29,30.48 | 68.26,30.88 69.29,30.48 | 68.26,30.08 69.29,30.48 | v68.1,30.48 68.26,30.08 | 68.26,30.88 69.29,30.48 | v68.1,30.48 68.26,30.88 | 68.26,30.08 69.29,30.48 | v68.1,30.48 68.26,30.08 | 67.95,30.08 66.91,30.48 | 67.95,30.08 | v68.1,30.48 67.95,30.08 | 67.95,30.88 66.91,30.48 | 66.91,30.48 67.95,30.08 | 66.91,30.48 67.95,30.88 | 67.95,30.08 66.91,30.48 | 67.95,30.08 v68.1,30.48 | 67.95,30.88 66.91,30.48 | 67.95,30.88 v68.1,30.48 | 75.8,30.48 | 76.84,30.08 75.8,30.48 | 76.84,30.08 | v76.99,30.48 76.84,30.08 | 76.84,30.88 75.8,30.48 | 75.8,30.48 76.84,30.08 | 75.8,30.48 76.84,30.88 | 76.84,30.08 75.8,30.48 | 76.84,30.08 v76.99,30.48 | 76.84,30.88 75.8,30.48 | 76.84,30.88 v76.99,30.48
  Bottom 0.406: 78.18,30.48 | 77.15,30.08 78.18,30.48 | 77.15,30.88 78.18,30.48 | 77.15,30.08 78.18,30.48 | v76.99,30.48 77.15,30.08 | 77.15,30.88 78.18,30.48 | v76.99,30.48 77.15,30.88 | 77.15,30.08 78.18,30.48 | v76.99,30.48 77.15,30.08 | 82.18,30.96 83.27,31.17 v83.19,31.59 | 82.18,30.96 82.84,31.85 v83.19,31.59 | 11.1,93.01 9.97,92.54 SV2.13 | 11.1,93.01 10.63,91.88 SV2.13
  Bottom 0.61: JP1.4 55.24,64.26 | 55.21,64.34 C45.1 | 55.21,64.34 55.21,65.44 53.98,66.67 49.61,66.67 | v48.42,66.67 49.61,66.67 | 49.61,66.67 48.51,66.99 v48.42,66.67 | 49.61,66.67 48.51,66.36 v48.42,66.67 | 55.21,64.34 54.81,63 JP1.4 | 55.21,64.34 55.68,63.02 JP1.4
  Bottom 0.813: 12.7,76.2 12.06,76.83 12.06,79.38 12.06,81.92 12.06,84.45 12.06,87 v12.06,92.08 | 12.7,76.2 13.34,75.56 26.35,75.56 v27.3,74.61 | S1.1 2.54,25.11 2.54,26.04 2.54,28.57 2.54,31.75 2.54,32.38 2.54,62.87 4.45,64.77 8.89,64.77 10.79,66.67 R70.2 | R70.1 10.79,74.3 12.7,76.2 | v48.42,66.67 48.42,69.69 47.62,70.48 47.62,73.95 | 47.62,73.95 48.03,74.95 DIS1.6@1 47.22,74.95 47.62,73.95 | DIS1.6 47.22,114.28 47.62,115.28 48.03,114.28 DIS1.6 | DIS1.6 48.03,113.95 47.62,112.95 47.22,113.95 DIS1.6 | 84.04,77.39 84.91,77.7 R35.3 84.35,78.25 84.04,77.39
+3V3_2  (via drill 0.7 pad 1.27)
  Top 0.406: v7.94,14.92 7.83,16.24 | IC12.8 35.56,16.51 34.92,15.88 30.48,15.88 25.4,10.79 13.97,10.79 13.32,11.45 13.32,12.06 14.05,12.06 | v15.24,12.06 14.05,12.06 | R20.2 66.12,13.97 | v67.31,13.97 66.12,13.97 | R18.2 75.58,13.97 76.28,13.97 | v77.47,13.97 76.28,13.97 | 83.91,14.43 84.92,14.43 v85.09,14.61 | 83.91,14.43 R16.2 | 7.83,16.24 7.78,16.1 | 7.78,16.1 7.45,15 v7.94,14.92 | 7.83,16.24 8.33,15.07 v7.94,14.92 | 7.83,16.24 7.83,16.94 6.99,17.78 IC13.10 | 14.05,12.06 | 14.05,12.06 15.08,11.66 | 14.05,12.06 15.08,12.47 | 15.08,12.47 | v15.24,12.06 15.08,12.47 | 66.12,13.97 | 66.12,13.97 67.15,13.57 | 66.12,13.97 67.15,14.37 | 67.15,14.37 | v67.31,13.97 67.15,14.37 | 76.28,13.97 | 76.28,13.97 77.31,13.57 | 76.28,13.97 77.31,14.37 | 77.31,14.37 | v77.47,13.97 77.31,14.37 | 8.32,15.11 | 8.32,15.11 | 7.52,15.04 7.84,16.11 | 7.52,15.04 | v7.94,14.92 7.52,15.04 | 8.32,15.11 7.84,16.11 | 8.32,15.11 | v7.94,14.92 8.32,15.11 | 7.52,15.04 7.84,16.11 | v7.94,14.92 7.52,15.04 | 8.32,15.11 7.84,16.11 | v7.94,14.92 8.32,15.11 | 7.78,16.1 7.52,15.03 v7.94,14.92 | 7.78,16.1 8.32,15.13 v7.94,14.92 | v7.94,14.92 7.53,15.06 7.88,16.11 8.33,15.1 v7.94,14.92 | 14.05,12.06 | 15.08,11.66 14.05,12.06 | 15.08,11.66 | v15.24,12.06 15.08,11.66 | 15.08,12.47 14.05,12.06 | 15.08,11.66 14.05,12.06 | 15.08,12.47 14.05,12.06 | 15.08,11.66 14.05,12.06 | v15.24,12.06 15.08,11.66 | 15.08,12.47 14.05,12.06 | v15.24,12.06 15.08,12.47 | 66.12,13.97 | 67.15,13.57 66.12,13.97 | 67.15,13.57 | v67.31,13.97 67.15,13.57 | 67.15,14.37 66.12,13.97 | 67.15,13.57 66.12,13.97 | 67.15,14.37 66.12,13.97 | 67.15,13.57 66.12,13.97 | v67.31,13.97 67.15,13.57 | 67.15,14.37 66.12,13.97 | v67.31,13.97 67.15,14.37 | 76.28,13.97 | 77.31,13.57 76.28,13.97
  Top 0.406: 77.31,13.57 | v77.47,13.97 77.31,13.57 | 77.31,14.37 76.28,13.97 | 77.31,13.57 76.28,13.97 | 77.31,14.37 76.28,13.97 | 77.31,13.57 76.28,13.97 | v77.47,13.97 77.31,13.57 | 77.31,14.37 76.28,13.97 | v77.47,13.97 77.31,14.37 | 83.91,14.43 84.99,14.18 v85.09,14.61 | 83.91,14.43 84.88,14.98 v85.09,14.61
  Top 0.61: 13.32,12.06 R24.2
  Bottom 0.406: C89.1 35.59,18.41 IC12.8 35.56,19.68 36.2,20.32 46.99,20.32 | v7.94,14.92 6.75,14.92 | 14.4,12.91 v15.24,12.06 | v7.94,14.92 9.13,14.92 | C86.1 48.23,18.41 IC10.8 46.99,20.32 | v67.31,13.97 68.5,13.97 | 76.28,13.97 v77.47,13.97 | v85.09,14.61 84.45,13.97 84.08,13.97 | v77.47,13.97 78.66,13.97 | 46.99,20.32 60.96,20.32 66.47,14.81 | 66.47,14.81 v67.31,13.97 | 14.4,12.91 12.38,14.92 9.13,14.92 | 6.75,14.92 | 6.75,14.92 R55.1 | 9.13,14.92 | 6.75,14.92 7.78,14.52 | 6.75,14.92 7.78,15.32 | 7.78,15.32 | v7.94,14.92 7.78,15.32 | 9.13,14.92 8.09,15.32 | 9.13,14.92 8.09,14.52 | 8.09,15.32 | v7.94,14.92 8.09,15.32 | 8.09,14.52 | 68.5,13.97 67.47,14.37 | 68.5,13.97 67.47,13.57 | 67.47,14.37 | v67.31,13.97 67.47,14.37 | 67.47,13.57 | 68.5,13.97 | 68.5,13.97 76.28,13.97 | 76.28,13.97 | 78.66,13.97 | 78.66,13.97 84.08,13.97 | 76.28,13.97 77.31,13.57 | 76.28,13.97 77.31,14.37 | 77.31,14.37 | 77.31,14.37 v77.47,13.97 | 78.66,13.97 77.63,14.37 | 78.66,13.97 77.63,13.57 | 77.63,14.37 | v77.47,13.97 77.63,14.37 | 77.63,13.57 | 6.75,14.92 | 7.78,14.52 6.75,14.92 | 7.78,14.52 | v7.94,14.92 7.78,14.52 | 7.78,15.32 6.75,14.92 | 7.78,14.52 6.75,14.92 | 7.78,15.32 6.75,14.92 | 7.78,14.52 6.75,14.92 | v7.94,14.92 7.78,14.52 | 7.78,15.32 6.75,14.92 | v7.94,14.92 7.78,15.32 | 9.13,14.92 | 8.09,14.52 9.13,14.92 | 8.09,15.32 9.13,14.92 | 8.09,14.52 9.13,14.92 | v7.94,14.92 8.09,14.52 | 8.09,15.32 9.13,14.92 | v7.94,14.92 8.09,15.32 | 8.09,14.52 9.13,14.92 | v7.94,14.92 8.09,14.52 | 14.4,12.91 14.85,11.89 v15.24,12.06 | 14.4,12.91 15.41,12.46 v15.24,12.06 | 68.5,13.97 | 67.47,13.57 68.5,13.97 | 67.47,14.37 68.5,13.97 | 67.47,13.57 68.5,13.97 | v67.31,13.97 67.47,13.57 | 67.47,14.37 68.5,13.97 | v67.31,13.97 67.47,14.37
  Bottom 0.406: 67.47,13.57 68.5,13.97 | v67.31,13.97 67.47,13.57 | 66.47,14.81 66.92,13.8 v67.31,13.97 | 66.47,14.81 67.48,14.37 v67.31,13.97 | 76.28,13.97 | 77.31,13.57 76.28,13.97 | 77.31,13.57 | v77.47,13.97 77.31,13.57 | 77.31,14.37 76.28,13.97 | 76.28,13.97 77.31,13.57 | 76.28,13.97 77.31,14.37 | 77.31,13.57 76.28,13.97 | 77.31,13.57 v77.47,13.97 | 77.31,14.37 76.28,13.97 | 77.31,14.37 v77.47,13.97 | 78.66,13.97 | 77.63,13.57 78.66,13.97 | 77.63,14.37 78.66,13.97 | 77.63,13.57 78.66,13.97 | v77.47,13.97 77.63,13.57 | 77.63,14.37 78.66,13.97 | v77.47,13.97 77.63,14.37 | 77.63,13.57 78.66,13.97 | v77.47,13.97 77.63,13.57 | 84.08,13.97 85.17,14.18 v85.09,14.61 | 84.08,13.97 84.74,14.86 v85.09,14.61
  Bottom 0.61: 7.36,20.95 C64.+ 7.97,20.34 C65.1 7.94,19.33 7.94,16.11 | v7.94,14.92 7.94,16.11 | 38.73,6.29 SV1.12 | 7.94,13.73 v7.94,14.92 | 7.94,16.11 7.62,15.01 | v7.94,14.92 7.62,15.01 | 7.94,16.11 8.26,15.01 | v7.94,14.92 8.26,15.01 | 7.94,13.73 8.26,14.83 | v7.94,14.92 8.26,14.83 | 7.94,13.73 7.94,9.84 15.24,2.54 35.56,2.54 38.73,5.71 38.73,6.29 | 7.94,13.73 7.62,14.83 | v7.94,14.92 7.62,14.83 | 7.62,15.01 7.94,16.11 8.26,15.01 | 7.94,16.11 7.62,15.01 | v7.94,14.92 7.62,15.01 | 7.94,16.11 8.26,15.01 | v7.94,14.92 8.26,15.01 | 7.94,13.73 8.26,14.83 | 7.94,13.73 7.62,14.83 | 8.26,14.83 7.94,13.73 7.62,14.83 | v7.94,14.92 8.26,14.83 | v7.94,14.92 7.62,14.83 | 38.73,6.29 39.12,7.5 | SV1.12 39.12,7.5 | 38.73,6.29 38.35,7.5 | SV1.12 38.35,7.5 | 38.73,6.29 39.12,7.5 | 38.73,6.29 38.35,7.5 | 39.12,7.5 38.73,6.29 | SV1.12 39.12,7.5 | 38.35,7.5 38.73,6.29 | SV1.12 38.35,7.5
  Bottom 0.813: 7.36,20.95 S1.2
+3V3AUDIO
  Bottom 0.305: 66.04,76.99 63.34,76.99 63.18,77.15 62.71,77.15
  Bottom 0.406: C55.1 63.5,89.31 IC5.14 | IC5.8 61.16,85.42 C58.1 C57.1 | L2.2 59.05,87.84 C59.1 | C59.1 59.05,85.41 | C57.1 59.1,85.37 59.1,85.61 C59.1 | C57.1 | C49.1 74.66,81.52 IC5.27 70.48,81.52 69.85,80.88 69.85,78.11 68.74,76.99 66.04,76.99 66.04,80.86 IC5.1 | 62.71,77.15 61.28,77.15 57.15,81.28 57.15,84.77 58.02,85.65 C59.1
  Bottom 0.61: L2.2 58.79,90.17 59.05,90.17 | 59.05,90.17 C56.+ | C55.1 C54.1 59.05,89.41 59.05,90.17
+5V  (via drill 0.7 pad 1.27, 0.7 pad 1.42)
  Top 0.254: C93.2 35.12,106.87 34.52,106.28 IC1.68
  Top 0.406: R5.2 6.35,109.2 6.35,107.95 8.26,106.05 12.06,106.05 12.35,105.76 C44.1 | v33.81,107.31 35,107.31 | 35,107.31 33.97,107.72 | v33.81,107.31 33.97,107.72 | 35,107.31 C93.2 | 35,107.31 33.97,106.91 | v33.81,107.31 33.97,106.91 | 35,107.31 33.97,107.72 | 35,107.31 33.97,106.91 | 33.97,107.72 35,107.31 | v33.81,107.31 33.97,107.72 | 33.97,106.91 35,107.31 | v33.81,107.31 33.97,106.91
  Top 0.61: v13.97,104.78 12.78,104.78 | TP1.PP 12.55,102.87 IC2.1 12.35,102.92 C44.1 12.78,104.78 | 12.78,104.78 13.83,105.16 | 13.83,104.39 12.78,104.78 | 13.83,104.39 | v13.97,104.78 13.83,104.39 | 13.83,105.16 12.78,104.78 | v13.97,104.78 13.83,105.16 | 12.78,104.78 13.83,104.39 | v13.97,104.78 13.83,104.39 | 12.78,104.78 13.83,105.16 | v13.97,104.78 13.83,105.16
  Bottom 0.406: 6.68,91.14 6.35,90.81 6.35,73.66 8.86,71.16 C66.1 19.4,71.12 IC6.14 22.86,71.12 23.65,70.33 R12.2 | 6.68,91.14 SV2.14 | v13.97,104.78 15.16,104.78 | 32.62,107.31 v33.81,107.31 | 15.16,104.78 14.19,105.23 | v13.97,104.78 14.19,105.23 | 15.16,104.78 19.68,104.78 21.11,106.2 28.73,106.2 29.84,107.31 32.62,107.31 | 15.16,104.78 14.19,104.32 | v13.97,104.78 14.19,104.32 | 15.16,104.78 14.19,105.23 | 15.16,104.78 14.19,104.32 | 14.19,105.23 15.16,104.78 | v13.97,104.78 14.19,105.23 | 14.19,104.32 15.16,104.78 | v13.97,104.78 14.19,104.32 | 32.62,107.31 33.66,106.91 | v33.81,107.31 33.66,106.91 | 32.62,107.31 33.66,107.72 | v33.81,107.31 33.66,107.72 | 33.66,106.91 32.62,107.31 | 33.66,107.72 32.62,107.31 | 32.62,107.31 33.66,106.91 | v33.81,107.31 33.66,106.91 | 32.62,107.31 33.66,107.72 | v33.81,107.31 33.66,107.72 | 6.68,91.14 7.81,91.61 SV2.14 | 6.68,91.14 7.15,92.27 SV2.14
  Bottom 0.61: 12.61,107.03 13.97,107.03 X1.1 | 12.61,107.03 C2.1 10.94,107.03 C1.+ | 13.99,105.97 13.99,105.67 | 13.99,105.97 X1.1 | v13.97,104.78 13.99,104.8 13.99,105.67 | 13.9,105.96 13.99,105.67 | 13.9,105.96 13.59,106.92 | 13.99,105.97 13.88,105.68 | 13.88,105.68 13.59,104.92 v13.97,104.78 | 13.99,105.97 14.35,104.91 v13.97,104.78 | v13.97,104.78 13.6,104.95 14.08,105.96 14.36,104.88 v13.97,104.78 | 13.9,105.96 13.58,104.89 v13.97,104.78 | 13.9,105.96 14.34,104.94 v13.97,104.78 | 13.99,105.67 14.39,106.92 | 14.39,106.92 X1.1 | 13.99,105.67 13.59,106.92 | 13.59,106.92 X1.1 | 13.88,105.68 14.38,106.89 X1.1 | 13.88,105.68 13.58,106.95 X1.1 | X1.1 14.4,106.95 14.09,105.68 13.6,106.89 X1.1 | 12.61,107.03 13.86,106.64 X1.1 | 12.61,107.03 13.85,107.45 X1.1 | 13.99,105.67 14.39,106.92 | 13.99,105.67 13.59,106.92 | 14.39,106.92 13.99,105.67 | 14.39,106.92 X1.1 | 13.59,106.92 13.99,105.67 | 13.59,106.92 X1.1
  Bottom 0.813: v13.97,104.78 TP1.PP 7.62,96.52 SV2.14
AGND  (via drill 0.7 pad 1.27)
  Top 0.305: 68.74,92.55 70.33,92.55
  Top 0.406: v66.04,91.28 66.04,91.6 66.71,92.27 | 73.55,99.49 73.66,99.38 | X2.P$1 83.08,101.49 81.28,99.69 81.28,97.16 78.74,94.61 75.25,94.61 | 73.55,99.49 75.25,97.79 75.25,94.61 | 73.55,99.49 v72.71,100.33 | 70.33,92.55 73.18,92.55 75.25,94.61 | 68.74,92.55 66.99,92.55 66.71,92.27 | 73.55,99.49 73.1,100.5 v72.71,100.33 | 73.55,99.49 72.53,99.94 v72.71,100.33 | 66.71,92.27 65.8,91.64 v66.04,91.28 | 66.71,92.27 66.46,91.19 v66.04,91.28
  Bottom 0.305: 66.41,87.36 IC5.11 67.2,87.36 67.47,87.63 67.47,89.85 66.88,90.44 | 66.88,90.44 v66.04,91.28 | IC5.15 72.96,89.31 73.18,89.53 73.18,89.85 73.47,90.14 C60.2 | 66.88,90.44 66.49,91.45 v66.04,91.28 | 66.88,90.44 65.87,90.83 v66.04,91.28
  Bottom 0.406: R7.1 80.33,86.67 80.64,87 R8.1 R9.1 R10.1 80.33,91.76 79.38,92.71 C61.- | R75.1 74.72,95.57 | v72.71,100.33 73.55,99.49 | 73.55,99.49 74.83,98.21 R75.1 | C61.- | C61.- 78.21,93.56 77.79,93.98 74.93,93.98 | 74.93,93.98 74.3,93.98 73.98,93.66 C60.2 | 74.93,93.98 74.77,93.98 74.77,95.57 R75.1 | 73.55,99.49 73.1,100.5 v72.71,100.33 | 73.55,99.49 72.53,99.94 v72.71,100.33
BCLK  (via drill 0.7 pad 1.27)
  Top 0.254: 41.91,102.39 40.96,102.39 40.02,103.33 IC1.57 40.02,105.39
  Top 0.305: 52.07,103.98 51.44,103.98 49.85,102.39 41.91,102.39
  Top 0.406: IC7.3 73.98,23.81 73.66,23.5 72.39,23.5 72.07,23.81 IC7.6 72.07,36.2 78.11,42.23 78.11,78.9 80.64,81.44 80.64,83.82 78.74,85.72 65.25,85.72 64.29,84.77 62.55,84.77 61.59,85.72 61.59,91.44 67.15,97 67.15,97.23 | 52.07,103.98 61.59,103.98 66.31,99.27 | v67.15,98.42 66.31,99.27 | 67.15,97.23 v67.15,98.42 | 67.15,97.23 | 67.15,97.23 67.55,98.27 | 67.15,97.23 66.75,98.27 | 67.55,98.27 | v67.15,98.42 67.55,98.27 | 66.75,98.27 | 66.31,99.27 66.76,98.25 v67.15,98.42 | 66.31,99.27 67.33,98.82 v67.15,98.42 | 67.15,97.23 | 66.75,98.27 67.15,97.23 | 67.15,97.23 67.55,98.27 | 67.15,97.23 66.75,98.27 | 66.75,98.27 v67.15,98.42 | 67.55,98.27 67.15,97.23 | 67.55,98.27 v67.15,98.42 | 66.75,98.27 67.15,97.23 | 66.75,98.27 v67.15,98.42
  Bottom 0.305: 67.15,95.41 67.15,94.77 69.85,92.08 69.85,90.33 69.37,89.85 69.37,87 68.26,85.88 68.26,82.71 68.9,82.07 68.9,78.26 68.26,77.63 67.31,77.63 66.67,78.26 66.67,79.38 67.63,80.33 67.63,81.6 67.06,82.17 IC5.3
  Bottom 0.406: v67.15,98.42 67.15,97.23 | 67.15,97.23 | 67.15,97.23 67.15,95.41 | 67.15,97.23 67.55,98.27 | 67.15,97.23 66.75,98.27 | 67.55,98.27 | v67.15,98.42 67.55,98.27 | 66.75,98.27 | 67.15,97.23 | 66.75,98.27 67.15,97.23 | 67.55,98.27 67.15,97.23 | 66.75,98.27 67.15,97.23 | v67.15,98.42 66.75,98.27 | 67.55,98.27 67.15,97.23 | v67.15,98.42 67.55,98.27 | 66.75,98.27 67.15,97.23 | v67.15,98.42 66.75,98.27
CODEC_DATA_IN  (via drill 0.7 pad 1.27)
  Top 0.406: 67.79,77.55 v67.79,78.74 | 76.12,63.34 v76.2,62.23 | 76.12,63.34 75.88,62.3 v76.2,62.23 | 76.12,63.34 76.52,62.31 v76.2,62.23 | 76.12,63.42 76.12,63.34 | 76.12,63.42 76.12,68.02 67.79,76.36 67.79,77.55 | 67.79,77.55 | 67.79,77.55 68.19,78.58 | 67.79,77.55 67.38,78.58 | 68.19,78.58 | v67.79,78.74 68.19,78.58 | 67.38,78.58 | 67.79,77.55 | 67.38,78.58 67.79,77.55 | 67.79,77.55 68.19,78.58 | 67.79,77.55 67.38,78.58 | 67.38,78.58 v67.79,78.74 | 68.19,78.58 67.79,77.55 | 68.19,78.58 v67.79,78.74 | 67.38,78.58 67.79,77.55 | 67.38,78.58 v67.79,78.74 | 76.12,63.42 75.79,62.36 v76.2,62.23 | 76.12,63.42 76.59,62.41 v76.2,62.23
  Bottom 0.305: IC5.4 67.36,82.81 68.26,81.92 68.26,79.93 | v67.79,78.74 68.23,79.84 | 68.23,79.84 68.26,79.93 | 68.19,79.86 68.26,79.93 | 68.19,79.86 67.34,78.94 v67.79,78.74 | 68.26,79.93 68.23,78.62 v67.79,78.74 | 68.26,79.83 67.46,79.09 v67.79,78.74 | 68.23,79.84 67.45,79.09 v67.79,78.74 | 68.23,79.84 68.27,78.76 v67.79,78.74 | 68.19,79.86 67.44,79.08 v67.79,78.74 | 68.19,79.86 68.27,78.77 v67.79,78.74 | 68.26,79.83 67.46,79.09 v67.79,78.74 | 68.26,79.83 68.27,78.74 v67.79,78.74
  Bottom 0.406: v76.2,62.23 77.39,62.23 | 77.39,62.23 | 77.39,62.23 83.93,62.23 | 83.93,62.23 S2.P | 77.39,62.23 76.36,62.63 | 77.39,62.23 76.36,61.83 | 76.36,62.63 | v76.2,62.23 76.36,62.63 | 76.36,61.83 | 77.39,62.23 | 76.36,61.83 77.39,62.23 | 76.36,62.63 77.39,62.23 | 76.36,61.83 77.39,62.23 | v76.2,62.23 76.36,61.83 | 76.36,62.63 77.39,62.23 | v76.2,62.23 76.36,62.63 | 76.36,61.83 77.39,62.23 | v76.2,62.23 76.36,61.83 | 83.93,62.23 84.87,61.77 S2.P | 83.93,62.23 84.87,62.69 S2.P
CON_BCLK  (via drill 0.7 pad 1.27)
  Top 0.406: v74.3,10.79 74.3,11.98 | IC7.11 72.07,20.64 72.23,20.8 | 72.23,20.8 | 72.23,20.8 72.39,20.95 73.66,20.95 73.98,20.64 IC7.14 73.98,12.38 74.3,12.06 74.3,11.98 | 74.3,11.98 | 74.3,11.98 73.89,10.95 | 74.3,11.98 74.7,10.95 | 74.7,10.95 | v74.3,10.79 74.7,10.95 | 74.3,11.98 | 73.89,10.95 74.3,11.98 | 73.89,10.95 | v74.3,10.79 73.89,10.95 | 74.7,10.95 74.3,11.98 | 73.89,10.95 74.3,11.98 | 74.7,10.95 74.3,11.98 | 73.89,10.95 74.3,11.98 | v74.3,10.79 73.89,10.95 | 74.7,10.95 74.3,11.98 | v74.3,10.79 74.7,10.95
  Bottom 0.406: SV1.4 48.9,6.99 49.46,6.42 | 49.46,6.42 49.53,6.35 57.31,6.35 61.75,10.79 73.11,10.79 | 73.11,10.79 v74.3,10.79 | 73.11,10.79 | 73.11,10.79 74.14,10.39 | 73.11,10.79 74.14,11.2 | 74.14,11.2 | 74.14,11.2 v74.3,10.79 | 73.11,10.79 | 74.14,10.39 73.11,10.79 | 74.14,10.39 | v74.3,10.79 74.14,10.39 | 74.14,11.2 73.11,10.79 | 73.11,10.79 74.14,10.39 | 73.11,10.79 74.14,11.2 | 74.14,10.39 73.11,10.79 | 74.14,10.39 v74.3,10.79 | 74.14,11.2 73.11,10.79 | 74.14,11.2 v74.3,10.79 | 49.46,6.42 49.4,7.64 SV1.4 | 49.46,6.42 48.55,7.24 SV1.4
CON_FRAME_SYNC
  Top 0.406: 72.71,17.78 IC7.12 | IC7.13 73.34,18.41 72.71,17.78 | 47.96,9.22 47.62,8.89 47.62,6.99 48.9,5.71 53.98,5.71 55.24,6.99 66.04,6.99 72.07,13.02 72.07,17.14 72.71,17.78 | 47.96,9.22 SV1.3 | 47.96,9.22 49.09,9.69 SV1.3 | 47.96,9.22 48.42,10.35 SV1.3
CON_FRME_SYNC_CNTRL  (1 unrouted)
  Top 0.406: IC7.10 71.44,13.34 65.72,7.62 54.93,7.62 53.66,6.35 50.8,6.35 50.16,6.99 R79.1 | R79.2 44.23,13.55 43.18,14.61 43.18,19.53 42.39,20.32 38.73,20.32 37.47,19.05 37.47,6.99 36.83,6.35 29.21,6.35 25.4,10.16 13.65,10.16 12.06,11.75 IC13.14
CON_MASTER_CLK
  Top 0.406: 63.82,17.78 63.82,12.38 59.69,8.26 54.61,8.26 53.98,7.62 52.76,7.62 | 63.82,17.78 IC8.13 | IC8.12 63.18,18.41 63.82,17.78 | 52.76,7.62 SV1.2 | 52.76,7.62 51.63,8.09 | SV1.2 51.63,8.09 | 52.76,7.62 51.63,7.15 | SV1.2 51.63,7.15 | 52.76,7.62 51.63,8.09 | 51.63,7.15 52.76,7.62 | 52.76,7.62 51.63,8.09 | SV1.2 51.63,8.09 | 51.63,7.15 52.76,7.62 | 51.63,7.15 SV1.2
CON_MCLK_CNTRL  (1 unrouted)
  Top 0.305: 49.37,12.7 50.96,12.7
  Top 0.406: IC8.10 61.91,18.26 56.36,12.7 50.96,12.7 | R78.1 40.64,12.7 40.01,12.06 40.01,6.35 39.37,5.71 28.89,5.71 25.08,9.53 13.34,9.53 11.43,11.43 11.43,17.46 10.79,18.1 IC13.13 | R78.2 49.37,12.7
CON_MUTE
  Bottom 0.305: 48.74,15.24 50.32,15.24
  Bottom 0.406: 42.21,8.56 SV1.10 | 42.21,8.56 42.55,8.89 44.45,8.89 45.09,9.53 45.09,15.24 | 45.09,15.24 44.45,15.88 IC10.7 | C85.2 53.07,15.07 R26.1 | 45.09,15.24 48.74,15.24 | C85.2 52.99,15.08 | 50.32,15.24 52.9,15.24 C85.2 | 42.21,8.56 41.08,8.09 SV1.10 | 42.21,8.56 41.74,7.43 SV1.10
CON_MUTE_CNTRL
  Top 0.305: 42.55,11.91 42.55,13.49
  Top 0.406: IC10.6 41.91,16.83 42.55,16.19 42.55,13.49 | 42.55,11.91 42.55,6.35 41.27,5.08 28.57,5.08 24.77,8.89 13.02,8.89 10.79,11.11 10.79,16.99 9.53,18.26 IC13.12
CON_RESET
  Bottom 0.406: R30.1 19.07,14.61 | 43.76,11.48 42.55,12.7 33.02,12.7 | 43.76,11.48 43.81,11.43 SV1.7 | 33.02,12.7 IC12.7 | 33.02,12.7 33.02,7.62 30,4.6 22.07,4.6 19.05,7.62 R30.1 | C90.2 17.99,14.59 R30.1 | 43.76,11.48 43.34,10.34 SV1.7 | 43.76,11.48 44.28,10.37 SV1.7
CON_RST_CNTRL  (via drill 0.7 pad 1.27)
  Top 0.406: 22.94,6.67 v24.13,6.67 | IC13.11 8.26,18.41 10.16,16.51 10.16,10.79 14.29,6.67 22.94,6.67 | 22.94,6.67 | 22.94,6.67 23.97,6.26 | 22.94,6.67 23.97,7.07 | 23.97,7.07 | 23.97,7.07 v24.13,6.67 | 22.94,6.67 | 23.97,6.26 22.94,6.67 | 23.97,6.26 | v24.13,6.67 23.97,6.26 | 23.97,7.07 22.94,6.67 | 22.94,6.67 23.97,6.26 | 22.94,6.67 23.97,7.07 | 23.97,6.26 22.94,6.67 | 23.97,6.26 v24.13,6.67 | 23.97,7.07 22.94,6.67 | 23.97,7.07 v24.13,6.67
  Bottom 0.406: IC12.6 30.48,13.02 24.97,7.51 | v24.13,6.67 24.97,7.51 | 24.97,7.51 23.96,7.06 v24.13,6.67 | 24.97,7.51 24.52,6.49 v24.13,6.67
CON_RX_DATA  (via drill 0.7 pad 1.27)
  Top 0.406: 59.62,5.08 59.53,5.08 59.39,5.18 | 59.62,5.08 74.3,5.08 80.64,11.43 IC4.6 | v58.42,5.87 59.39,5.18 | 59.45,5.29 58.8,6.07 v58.42,5.87 | 59.45,5.29 59.62,5.08 | 59.37,5.15 58.27,5.47 v58.42,5.87 | 59.37,5.15 59.62,5.08 | 59.39,5.18 | 59.39,5.18 58.78,6.11 | 59.39,5.18 | 58.31,5.46 59.39,5.18 | 58.31,5.46 | 59.37,5.15 | 58.79,6.1 59.37,5.15 | 59.37,5.15 | 59.37,5.15 58.3,5.46 v58.42,5.87 | 59.39,5.18 58.78,6.11 | v58.42,5.87 58.78,6.11 | 59.39,5.18 58.31,5.46 | 58.78,6.11 59.39,5.18 | v58.42,5.87 58.78,6.11 | 58.31,5.46 59.39,5.18 | v58.42,5.87 58.31,5.46 | 59.45,5.29 58.76,6.15 v58.42,5.87 | 59.45,5.29 58.36,5.45 v58.42,5.87 | 58.79,6.1 59.37,5.15 | v58.42,5.87 58.79,6.1 | 58.3,5.46 59.37,5.15 | 58.79,6.1 59.37,5.15 | v58.42,5.87 58.79,6.1 | 58.3,5.46 59.37,5.15 | v58.42,5.87 58.3,5.46
  Bottom 0.406: 43.81,6.29 SV1.8 | 59.26,5.03 59.53,4.76 59.53,3.65 59.05,3.17 57.31,3.17 56.83,3.65 45.88,3.65 43.81,5.71 43.81,6.29 | 59.26,5.03 v58.42,5.87 | 59.26,5.03 58.81,6.05 v58.42,5.87 | 59.26,5.03 58.25,5.48 v58.42,5.87 | 43.81,6.29 44.28,7.42 | SV1.8 44.28,7.42 | 43.81,6.29 43.35,7.42 | SV1.8 43.35,7.42 | 43.81,6.29 44.28,7.42 | 43.35,7.42 43.81,6.29 | 43.81,6.29 44.28,7.42 | SV1.8 44.28,7.42 | 43.35,7.42 43.81,6.29 | 43.35,7.42 SV1.8
CON_TX_DATA  (via drill 0.7 pad 1.27)
  Top 0.406: IC4.7 81.92,18.41 81.28,17.78 81.28,11.11 74.45,4.29 59.45,4.29 | v58.26,4.29 59.45,4.29 | 59.45,4.29 | 59.45,4.29 58.42,4.69 | 59.45,4.29 58.42,3.88 | 58.42,4.69 | v58.26,4.29 58.42,4.69 | 58.42,3.88 | 59.45,4.29 | 58.42,3.88 59.45,4.29 | 58.42,4.69 59.45,4.29 | 58.42,3.88 59.45,4.29 | v58.26,4.29 58.42,3.88 | 58.42,4.69 59.45,4.29 | v58.26,4.29 58.42,4.69 | 58.42,3.88 59.45,4.29 | v58.26,4.29 58.42,3.88
  Bottom 0.406: 46.35,6.29 SV1.6 | 57.07,4.29 v58.26,4.29 | 57.07,4.29 47.78,4.29 46.35,5.71 46.35,6.29 | 57.07,4.29 | 57.07,4.29 58.1,3.88 | 57.07,4.29 58.1,4.69 | 58.1,4.69 | 58.1,4.69 v58.26,4.29 | 57.07,4.29 | 58.1,3.88 57.07,4.29 | 58.1,3.88 | v58.26,4.29 58.1,3.88 | 58.1,4.69 57.07,4.29 | 57.07,4.29 58.1,3.88 | 57.07,4.29 58.1,4.69 | 58.1,3.88 57.07,4.29 | 58.1,3.88 v58.26,4.29 | 58.1,4.69 57.07,4.29 | 58.1,4.69 v58.26,4.29 | 46.35,6.29 46.82,7.42 | SV1.6 46.82,7.42 | 46.35,6.29 45.89,7.42 | SV1.6 45.89,7.42 | 46.35,6.29 46.82,7.42 | 46.35,6.29 45.89,7.42 | 46.82,7.42 46.35,6.29 | SV1.6 46.82,7.42 | 45.89,7.42 46.35,6.29 | SV1.6 45.89,7.42
DBG0
  Top 0.254: IC1.107 29.84,85.72
  Top 0.305: 26.67,85.41 26.99,85.73 29.84,85.73 29.84,85.72
  Top 0.406: 26.67,85.41 20.95,79.69 20.95,78.11 19.68,76.83 11.49,76.83 | SV2.1 11.49,76.83 | 11.49,76.83 10.36,77.3 | SV2.1 10.36,77.3 | 11.49,76.83 10.36,76.37 | SV2.1 10.36,76.37 | 11.49,76.83 10.36,77.3 | 11.49,76.83 10.36,76.37 | 10.36,77.3 11.49,76.83 | SV2.1 10.36,77.3 | 10.36,76.37 11.49,76.83 | SV2.1 10.36,76.37
DBG1
  Top 0.305: IC1.105 27.04,86.73 26.67,86.36
  Top 0.406: 8.56,77.77 SV2.2 | 8.56,77.77 8.89,78.11 13.81,78.11 14.45,77.47 19.37,77.47 20.32,78.42 20.32,80.01 26.67,86.36 | 8.56,77.77 7.43,77.3 SV2.2 | 8.56,77.77 8.09,76.64 SV2.2
DBG2
  Top 0.305: IC1.103 27.09,87.73 26.83,87.47